# EAGLE design NanoGwSchm (EAGLE 7.2.0)
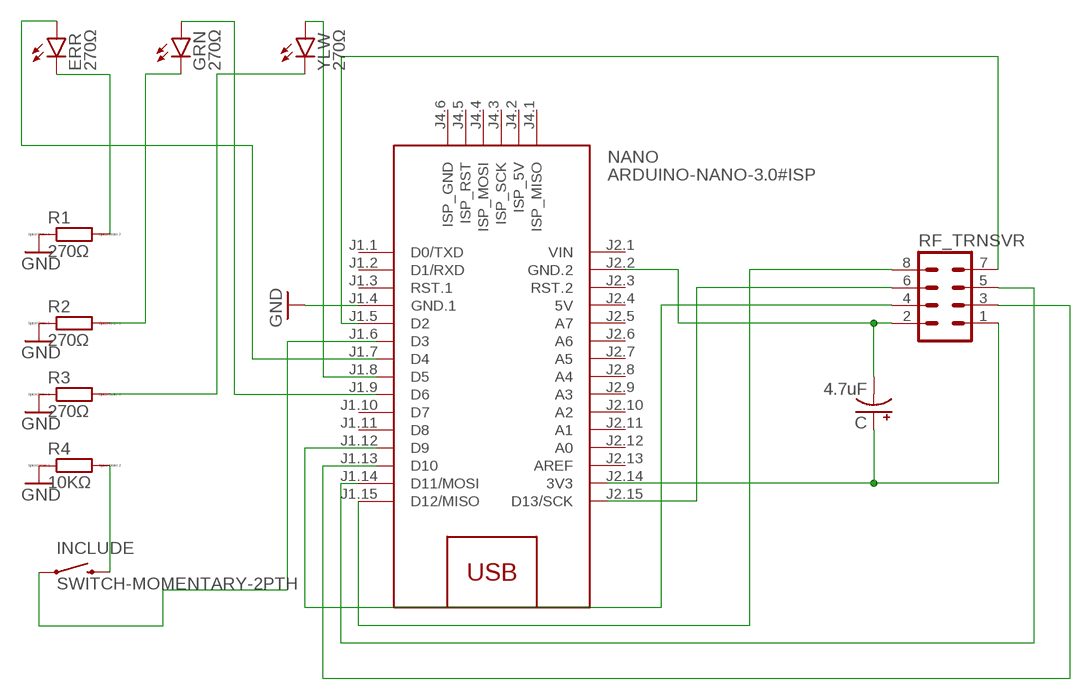
[diagram p0: schematic, sheet 1]

## Parts
C  4.7uF  CPOL-USE2-5  [E2-5]
ERR  270Ω  LED5MM  [LED5MM]
GRN  270Ω  LED5MM  [LED5MM]
INCLUDE  SWITCH-MOMENTARY-2PTH  [TACTILE-PTH]
NANO  ARDUINO-NANO-3.0#ISP  [ARDUINO-NANO-3.0#ISP]
R1  270Ω  R0204/7  [0204/7]
R2  270Ω  R0204/7  [0204/7]
R3  270Ω  R0204/7  [0204/7]
R4  10KΩ  R0204/7  [0204/7]
RF_TRNSVR  MA04-2  [MA04-2]
YLW  270Ω  LED5MM  [LED5MM]

## Nets
GND: NANO.J1.4(GND.1) R1.1 R2.1 R3.1 R4.1
N$1: ERR.K(C) R1.2
N$2: GRN.K(C) R2.2
N$3: R3.2 YLW.K(C)
N$4: INCLUDE.3 R4.2
N$5: INCLUDE.1
N$6: C.- NANO.J2.2(GND.2) RF_TRNSVR.2
N$7: GRN.A
N$8: YLW.A
N$9: ERR.A
N$10: RF_TRNSVR.3
N$11: NANO.J1.14(D11/MOSI) RF_TRNSVR.5
N$12: NANO.J1.5(D2) RF_TRNSVR.7
N$13: RF_TRNSVR.4
N$14: RF_TRNSVR.6
N$15: NANO.J1.15(D12/MISO) RF_TRNSVR.8
N$16: C.+ RF_TRNSVR.1
Unconnected: NANO.J1.1(D0/TXD) NANO.J1.2(D1/RXD) NANO.J1.3(RST.1) NANO.J1.6(D3) NANO.J1.7(D4) NANO.J1.8(D5) NANO.J1.9(D6) NANO.J1.10(D7) NANO.J1.11(D8) NANO.J1.12(D9) NANO.J1.13(D10) NANO.J2.3(RST.2) NANO.J2.5(A7) NANO.J2.6(A6) NANO.J2.7(A5) NANO.J2.8(A4) NANO.J2.9(A3) NANO.J2.10(A2) NANO.J2.11(A1) NANO.J2.12(A0) NANO.J2.13(AREF) NANO.J2.15(D13/SCK) NANO.J4.1(ISP_MISO) NANO.J4.2(ISP_5V) NANO.J4.3(ISP_SCK) NANO.J4.4(ISP_MOSI) NANO.J4.5(ISP_RST) NANO.J4.6(ISP_GND)

## Power pins joined to a net without a drawn wire
3V3: NANO.J2.14(3V3)
5V: NANO.J2.4(5V)
VIN: NANO.J2.1(VIN)

## Library data of the parts
C = rcl:CPOL-US: POLARIZED CAPACITOR, American symbol
ERR GRN YLW = SparkFun-LED:LED: LEDs Standard schematic elements and footprints for 5mm, 3mm, 1206, and 0603 sized LEDs. 5mm - Spark Fun Electronics SKU : COM-00529 (and others)
INCLUDE = SparkFun-Electromechanical:SWITCH-MOMENTARY-2: Various NO switches- pushbuttons, reed, etc; PROD_ID: SWCH-08441
NANO = diy-modules 3:ARDUINO-NANO-3.0#ISP: Arduino Nano 3.0 with ISP pads
R1-R4 = eagle-ltspice:R: RESISTOR, European symbol; SPICEMODEL: NONE; SPICEPREFIX: R
RF_TRNSVR = con-lstb:MA04-2: PIN HEADER; OC_FARNELL: unknown; OC_NEWARK: unknown

## Net classes
0 default: width 0.305 mm, drill 0.508 mm, clearance 0.254 mm

## Board
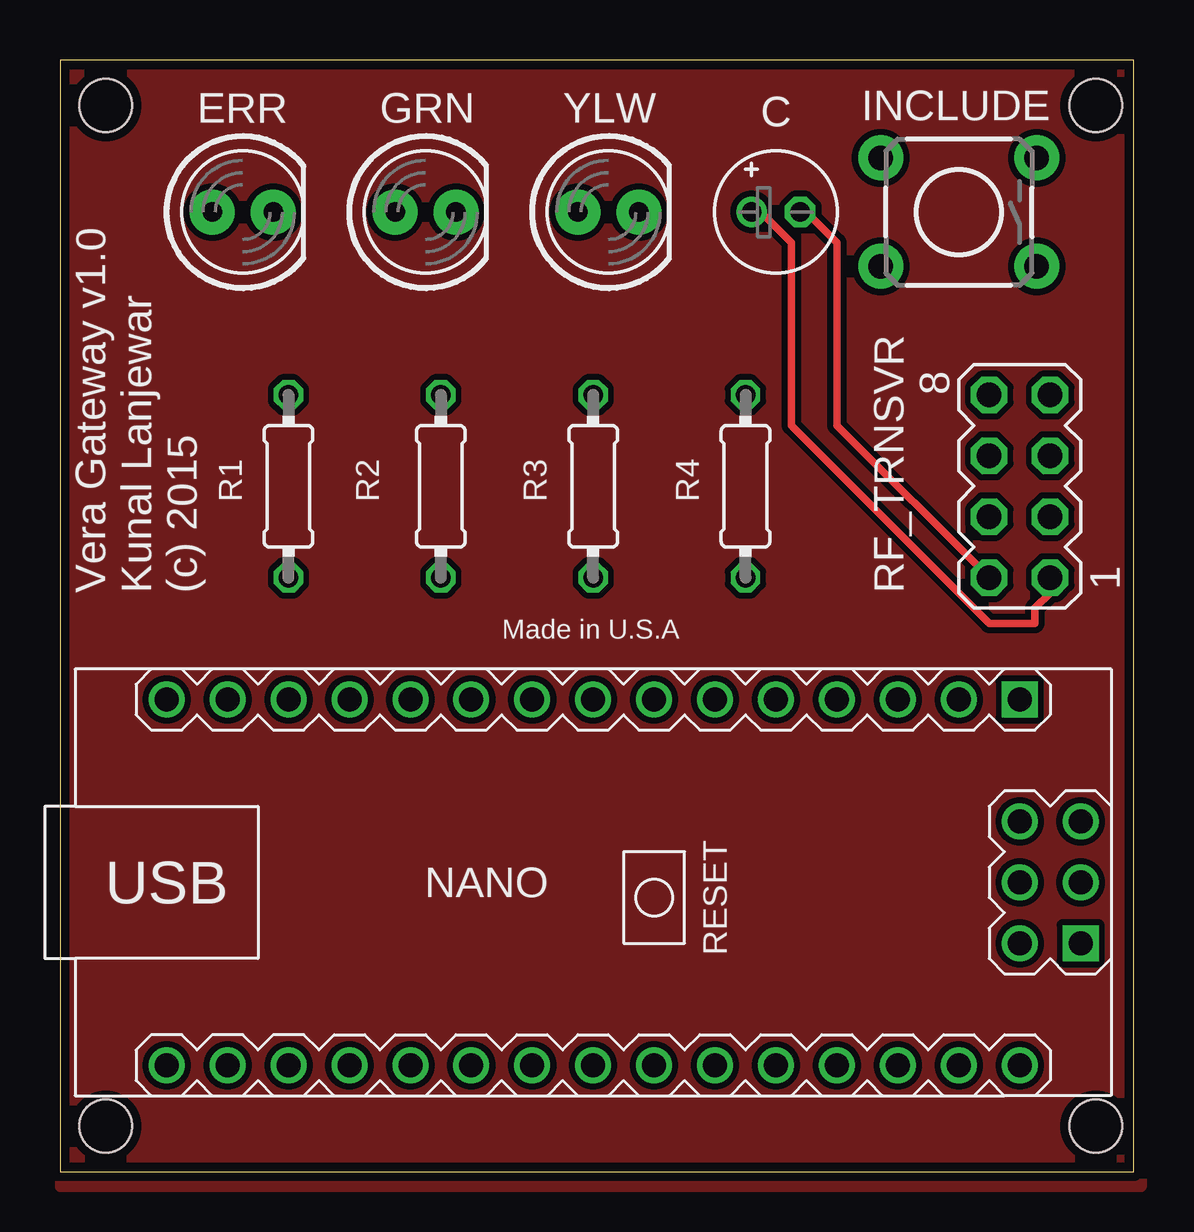
[diagram p1: board, top side]
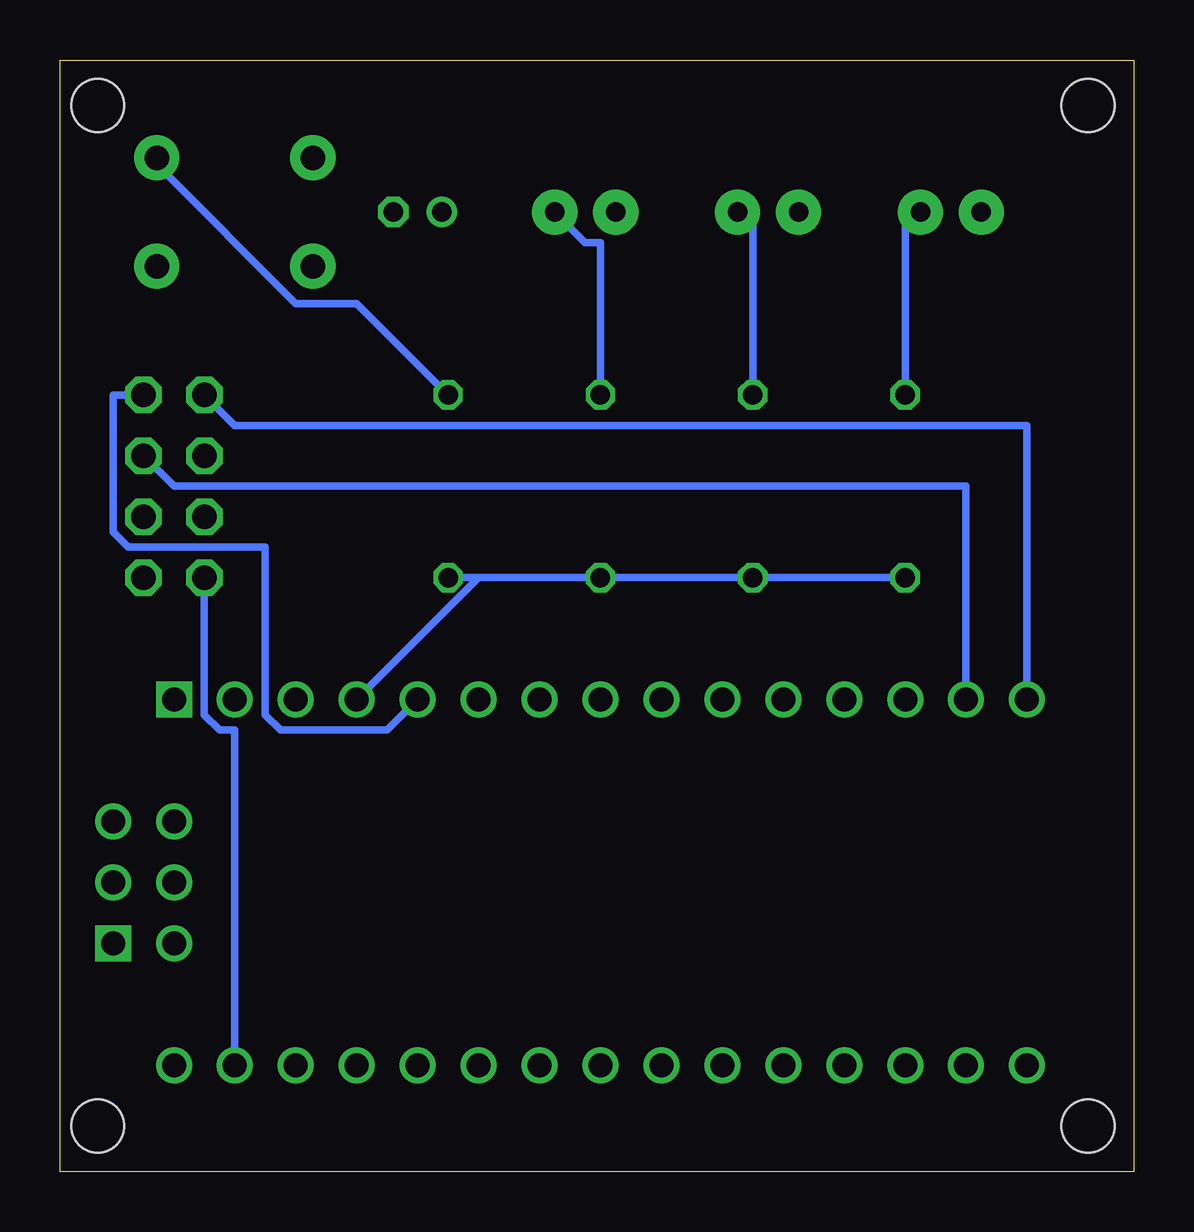
[diagram p2: board, bottom side, seen from below]

Size 44.76 x 46.34 mm. Coordinates in mm from the lower left corner, seen from the top.
Outline: 0,0 44.76,0 44.76,46.34 0,46.34 0,0
Copper layers (1*16): Top 0.0356mm / dielectric 1.5011mm / Bottom 0.0356mm
Design rules "LaenPCBOrder": minimum track width 6mil, minimum drill 13mil, track to track 6mil, track to pad 6mil, pad to pad 6mil, via to via 6mil, smd to smd 6mil, copper to edge 15mil, drill to drill 6mil, minimum pad ring 7mil, minimum via ring 7mil, stop-mask expansion 3mil, vias tented up to drill 0mil, thermal gap 10mil
Holes 2.2 mm at 43.18,1.91 1.91,1.91 1.91,44.45 43.18,44.45

### Footprints (pad centres in the part's own frame; a part is rotated, then mirrored left to right if it is on the bottom)
E2-5 = drill 0.813 pad 1.27: + -1.016,0 | drill 0.813 pad 1.27 octagon: - 1.016,0
LED5MM = drill 0.813 pad 1.88: A -1.27,0; K 1.27,0
TACTILE-PTH = drill 1.016 pad 1.88: 1 -3.251,2.261; 2 3.251,2.261; 3 -3.251,-2.261; 4 3.251,-2.261
ARDUINO-NANO-3.0#ISP = drill 1 square: J1.1 17.78,7.62; J4.1 20.32,-2.54 | drill 1: J1.2 15.24,7.62; J1.3 12.7,7.62; J1.4 10.16,7.62; J1.5 7.62,7.62; J1.6 5.08,7.62; J1.7 2.54,7.62; J1.8 0,7.62; J1.9 -2.54,7.62; J1.10 -5.08,7.62; J1.11 -7.62,7.62; J1.12 -10.16,7.62; J1.13 -12.7,7.62; J1.14 -15.24,7.62; J1.15 -17.78,7.62; J2.1 17.78,-7.62; J2.2 15.24,-7.62; J2.3 12.7,-7.62; J2.4 10.16,-7.62; J2.5 7.62,-7.62; J2.6 5.08,-7.62; J2.7 2.54,-7.62; J2.8 0,-7.62; J2.9 -2.54,-7.62; J2.10 -5.08,-7.62; J2.11 -7.62,-7.62; J2.12 -10.16,-7.62; J2.13 -12.7,-7.62; J2.14 -15.24,-7.62; J2.15 -17.78,-7.62; J4.2 17.78,-2.54; J4.3 20.32,0; J4.4 17.78,0; J4.5 20.32,2.54; J4.6 17.78,2.54
0204/7 = drill 0.813 octagon: 1 -3.81,0; 2 3.81,0
MA04-2 = drill 1.016 octagon: 1 -3.81,-1.27; 2 -3.81,1.27; 3 -1.27,-1.27; 4 -1.27,1.27; 5 1.27,-1.27; 6 1.27,1.27; 7 3.81,-1.27; 8 3.81,1.27

### Placement (x,y rotation side)
C  29.84,40.01 0 top
ERR  7.62,40.01 0 top
GRN  15.24,40.01 0 top
INCLUDE  37.47,40.01 180 top
NANO  22.23,12.06 0 top
R1  9.53,28.57 90 top
R2  15.88,28.57 90 top
R3  22.23,28.57 90 top
R4  28.57,28.57 90 top
RF_TRNSVR  40.01,28.57 90 top
YLW  22.86,40.01 0 top

### Tracks (layer width: path | path; a pad name or v marks a point on that pad's centre or on a via)
GND
  Bottom 0.305: R1.1 R2.1 R3.1 27.3,24.77 | 27.3,24.77 R4.1 | 27.3,24.77 NANO.J1.4
N$1
  Bottom 0.305: R1.2 9.53,40.01 ERR.K
N$2
  Bottom 0.305: R2.2 15.88,40.01 GRN.K
N$3
  Bottom 0.305: R3.2 22.23,38.73 22.86,38.73 YLW.K
N$4
  Bottom 0.305: R4.2 32.38,36.2 34.92,36.2 40.64,41.91 INCLUDE.3
N$6
  Top 0.305: RF_TRNSVR.2 32.38,31.11 32.38,38.73 31.11,40.01 C.-
  Bottom 0.305: NANO.J2.2 37.47,18.41 38.1,18.41 38.73,19.05 RF_TRNSVR.2
N$11
  Bottom 0.305: NANO.J1.14 6.99,28.57 40.01,28.57 RF_TRNSVR.5
N$12
  Bottom 0.305: NANO.J1.5 31.11,18.41 35.56,18.41 36.2,19.05 36.2,26.04 41.91,26.04 42.55,26.67 42.55,32.38 RF_TRNSVR.7
N$15
  Bottom 0.305: NANO.J1.15 4.45,31.11 37.47,31.11 RF_TRNSVR.8
N$16
  Top 0.305: RF_TRNSVR.1 41.27,24.13 40.64,23.5 40.64,22.86 38.73,22.86 30.48,31.11 30.48,38.73 29.21,40.01 C.+
N$17
  pour Top: 0,46.35 45.09,46.35 45.09,-0.64 0,-0.64

### Text on the board
tPlace: Vera Gateway v1.0 / Kunal Lanjewar / (c) 2015 | Made in U.S.A